# Altium schematic sheet SP3485EEN.schdoc
size 127 x 101 mm
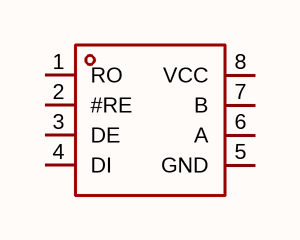
[diagram p0: SP3485EEN.schdoc]

## Parts
U?  sp3485een(umw)  [SOP-8_L5.0-W4.0-P1.27-LS6.0-BL]  (value not drawn)

## Nets

Not connected (* = marked no-connect by the designer): U? 1(RO) 2(#RE) 3(DE) 4(DI) 5(GND) 6(A) 7(B) 8(VCC)

## Library data of the parts
U? = sp3485een(umw): 类型:收发器;数据速率:12Mbps;; Manufacturer: UMW(友台半导体); AddInBom: yes; ModelId: a3315c1c78f949e6bb82c6eaca1c53c7; ModelName: SOP-8_L5.0-W4.0-H1.8-LS6.2-P1.27; ModelTransform: 244.094,196.85,0,90,0,0,0,0,0; Number of Drivers: 1; Voltage - Supply: 2.97V~3.63V; Data Rate: 12Mbps; Number of Nodes: 256; Supply Current (Iq): 520uA; Communication Mode: 半双工; Symbol: SP3485EEN; LCSC Part Name: SP3485E 3.3V电源，最多256个节点，12Mbps半双工，RS485/RS422收发器; SupplierPart: C668205; ManufacturerPart: SP3485EEN(UMW); Supplier Footprint: SOP-8; JLCPCB Part Class: Extended Part; Datasheet: https://item.szlcsc.com/datasheet/SP3485EEN(UMW)/698053.html; Supplier: LCSC; ConvertToPcb: yes; FootprintName: SOP-8_L5.0-W4.0-P1.27-LS6.0-BL; Type: 收发器; Number of Receivers: 1; Operating Temperature: -40℃~+85℃